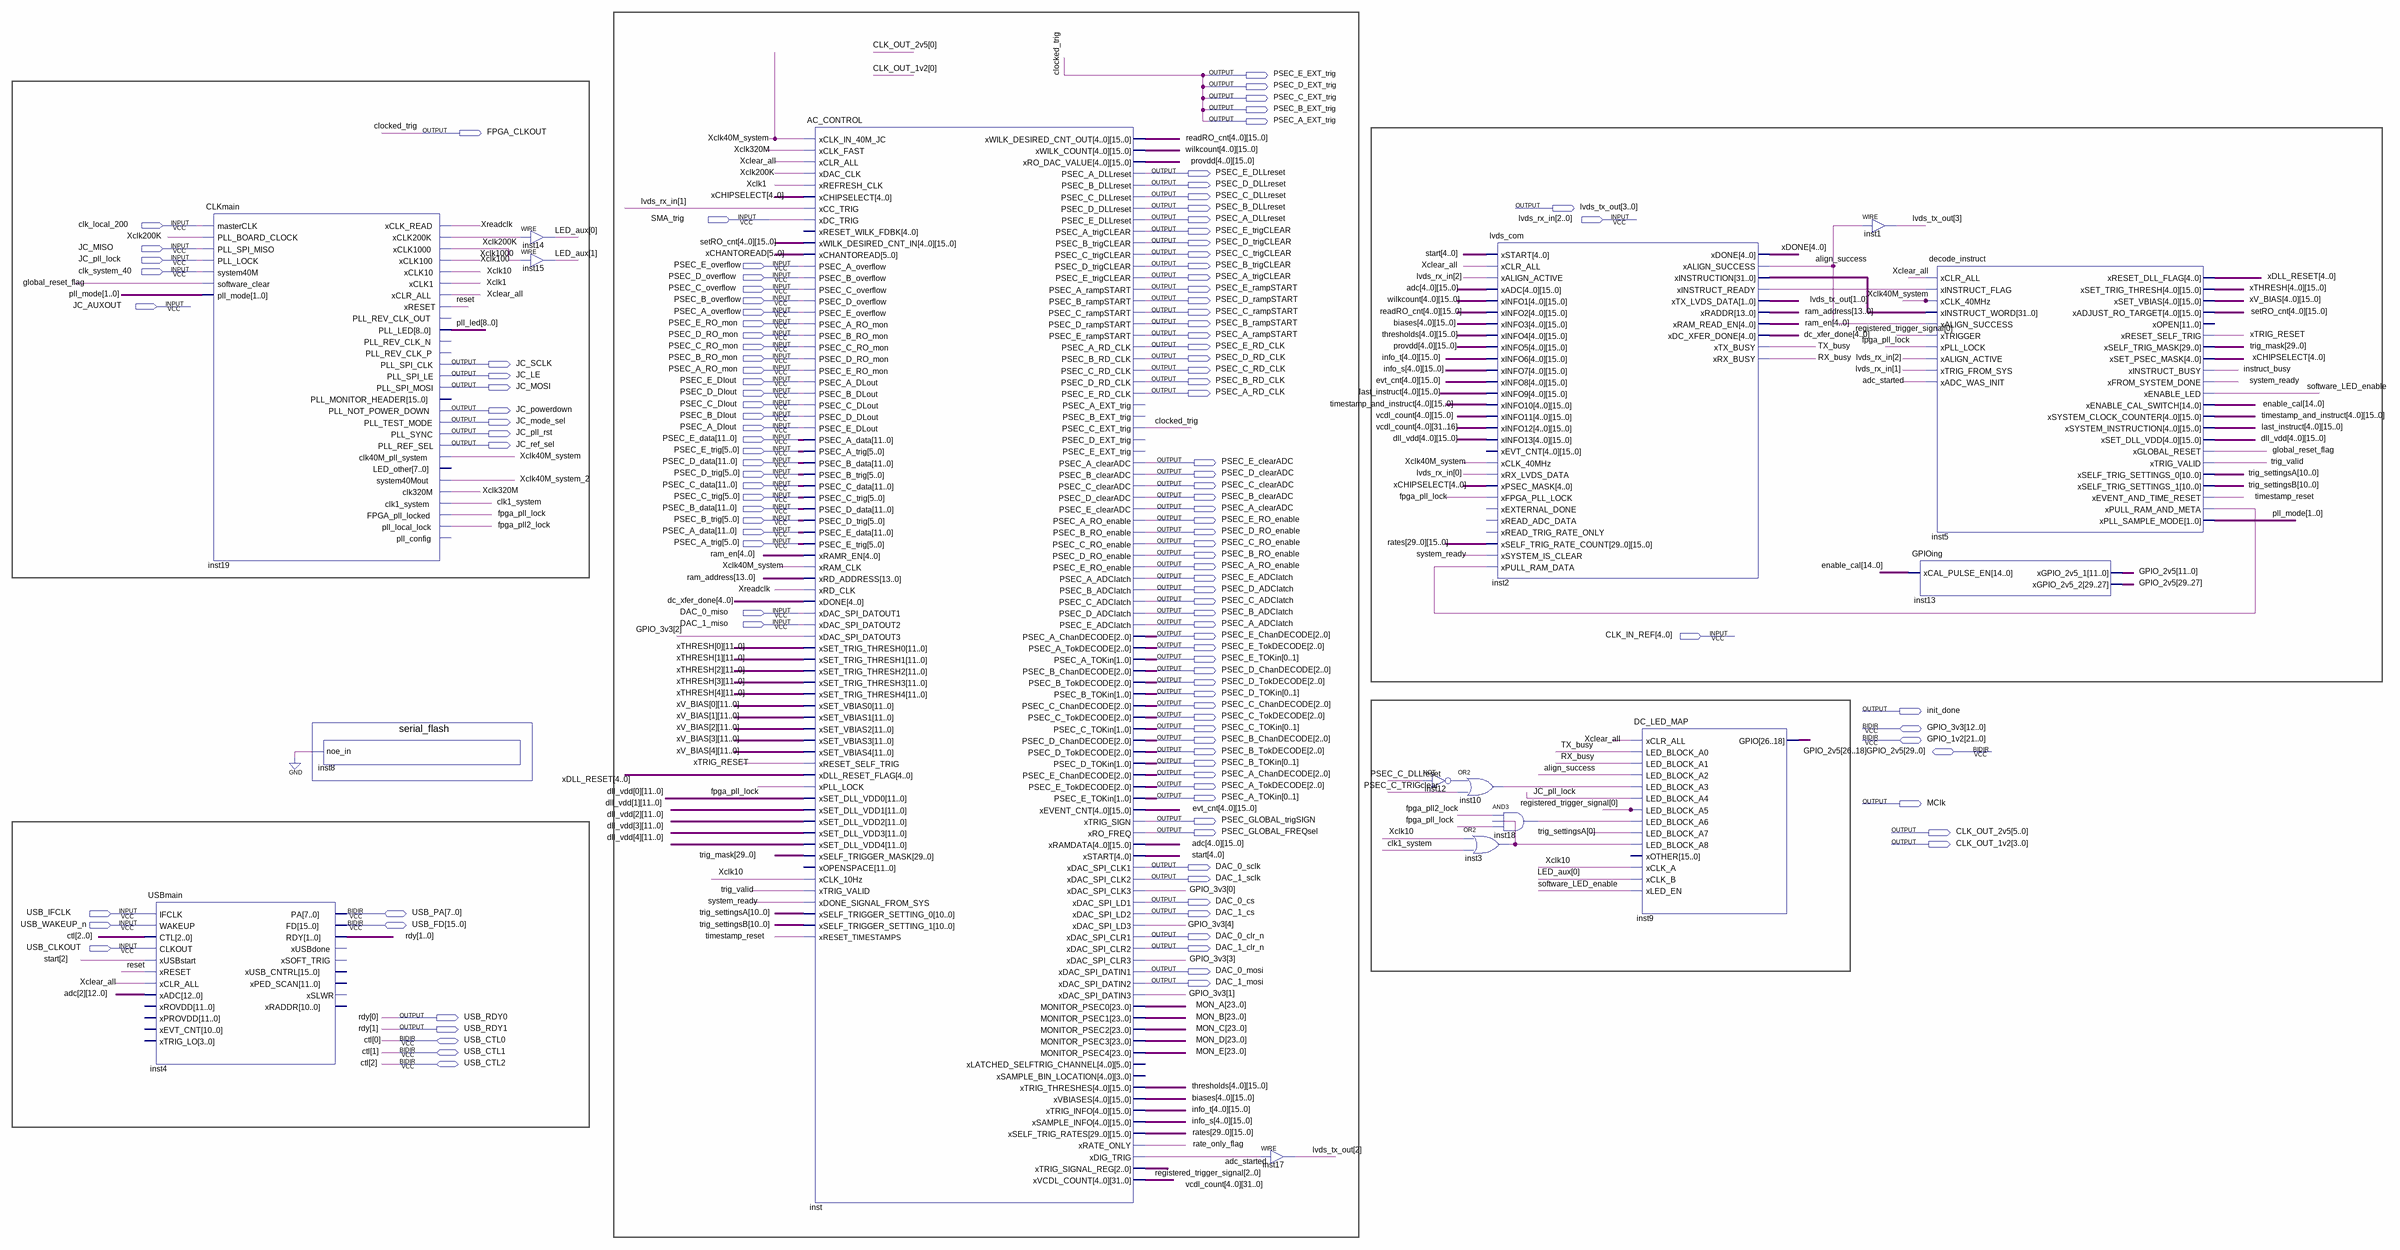
[diagram p0: schematic sheet]
// Quartus schematic ACDC_top_level.bdf as structural Verilog: 16 symbols, 126 pins
module ACDC_top_level (
  input  SMA_trig,
  input  [2:0] lvds_rx_in,
  input  clk_local_200,
  input  JC_MISO,
  input  JC_pll_lock,
  input  PSEC_E_overflow,
  input  clk_system_40,
  input  PSEC_D_overflow,
  input  PSEC_C_overflow,
  input  PSEC_B_overflow,
  input  JC_AUXOUT,
  input  PSEC_A_overflow,
  input  PSEC_E_RO_mon,
  input  PSEC_D_RO_mon,
  input  PSEC_C_RO_mon,
  input  PSEC_B_RO_mon,
  input  PSEC_A_RO_mon,
  input  PSEC_E_DIout,
  input  PSEC_D_DIout,
  input  PSEC_C_DIout,
  input  PSEC_B_DIout,
  input  PSEC_A_DIout,
  input  [11:0] PSEC_E_data,
  input  [5:0] PSEC_E_trig,
  input  [11:0] PSEC_D_data,
  input  [5:0] PSEC_D_trig,
  input  [11:0] PSEC_C_data,
  input  [5:0] PSEC_C_trig,
  input  [11:0] PSEC_B_data,
  input  [5:0] PSEC_B_trig,
  input  [11:0] PSEC_A_data,
  input  [5:0] PSEC_A_trig,
  input  DAC_0_miso,
  input  DAC_1_miso,
  input  [4:0] CLK_IN_REF,
  input  USB_IFCLK,
  input  USB_WAKEUP_n,
  input  USB_CLKOUT,
  inout  [12:0] GPIO_3v3,
  inout  [21:0] GPIO_1v2,
  inout  [29:0] GPIO_2v5,
  inout  [7:0] USB_PA,
  inout  [15:0] USB_FD,
  inout  USB_CTL0,
  inout  USB_CTL1,
  inout  USB_CTL2,
  output PSEC_E_EXT_trig,
  output PSEC_D_EXT_trig,
  output PSEC_C_EXT_trig,
  output PSEC_B_EXT_trig,
  output PSEC_A_EXT_trig,
  output FPGA_CLKOUT,
  output PSEC_E_DLLreset,
  output PSEC_D_DLLreset,
  output PSEC_C_DLLreset,
  output PSEC_B_DLLreset,
  output [3:0] lvds_tx_out,
  output PSEC_A_DLLreset,
  output PSEC_E_trigCLEAR,
  output PSEC_D_trigCLEAR,
  output PSEC_C_trigCLEAR,
  output PSEC_B_trigCLEAR,
  output PSEC_A_trigCLEAR,
  output PSEC_E_rampSTART,
  output PSEC_D_rampSTART,
  output PSEC_C_rampSTART,
  output PSEC_B_rampSTART,
  output PSEC_A_rampSTART,
  output PSEC_E_RD_CLK,
  output PSEC_D_RD_CLK,
  output JC_SCLK,
  output PSEC_C_RD_CLK,
  output JC_LE,
  output PSEC_B_RD_CLK,
  output JC_MOSI,
  output PSEC_A_RD_CLK,
  output JC_powerdown,
  output JC_mode_sel,
  output JC_pll_rst,
  output JC_ref_sel,
  output PSEC_E_clearADC,
  output PSEC_D_clearADC,
  output PSEC_C_clearADC,
  output PSEC_B_clearADC,
  output PSEC_A_clearADC,
  output PSEC_E_RO_enable,
  output PSEC_D_RO_enable,
  output PSEC_C_RO_enable,
  output PSEC_B_RO_enable,
  output PSEC_A_RO_enable,
  output PSEC_E_ADClatch,
  output PSEC_D_ADClatch,
  output PSEC_C_ADClatch,
  output PSEC_B_ADClatch,
  output PSEC_A_ADClatch,
  output [2:0] PSEC_E_ChanDECODE,
  output [2:0] PSEC_E_TokDECODE,
  output [0:1] PSEC_E_TOKin,
  output [2:0] PSEC_D_ChanDECODE,
  output [2:0] PSEC_D_TokDECODE,
  output [0:1] PSEC_D_TOKin,
  output [2:0] PSEC_C_ChanDECODE,
  output init_done,
  output [2:0] PSEC_C_TokDECODE,
  output [0:1] PSEC_C_TOKin,
  output [2:0] PSEC_B_ChanDECODE,
  output [2:0] PSEC_B_TokDECODE,
  output [0:1] PSEC_B_TOKin,
  output [2:0] PSEC_A_ChanDECODE,
  output [2:0] PSEC_A_TokDECODE,
  output [0:1] PSEC_A_TOKin,
  output MClk,
  output PSEC_GLOBAL_trigSIGN,
  output PSEC_GLOBAL_FREQsel,
  output [5:0] CLK_OUT_2v5,
  output [3:0] CLK_OUT_1v2,
  output DAC_0_sclk,
  output DAC_1_sclk,
  output DAC_0_cs,
  output DAC_1_cs,
  output DAC_0_clr_n,
  output DAC_1_clr_n,
  output DAC_0_mosi,
  output DAC_1_mosi,
  output USB_RDY0,
  output USB_RDY1
);

  wire adc_started, align_success, clk1_system, fpga_pll2_lock, fpga_pll_lock, global_reset_flag,
       inst2_xinstruct_ready, inst3_out, inst5_xpull_ram_and_meta, inst10_out, inst12_out, inst18_out,
       instruct_busy, rate_only_flag, reset, RX_busy, software_LED_enable, system_ready, timestamp_reset,
       trig_valid, TX_busy, Xclear_all, Xclk1, Xclk10, Xclk40M_system, Xclk40M_system_2, Xclk100, Xclk200K,
       Xclk320M, Xclk1000, Xreadclk, xTRIG_RESET;
  wire [1:0] LED_aux, pll_mode;
  wire [2:0] registered_trigger_signal;
  wire [4:0] dc_xfer_done, ram_en, start, xCHIPSELECT, xDLL_RESET, xDONE;
  wire [5:0] xCHANTOREAD;
  wire [8:0] pll_led;
  wire [10:0] trig_settingsA, trig_settingsB;
  wire [13:0] ram_address;
  wire [14:0] enable_cal;
  wire [15:0] adc_0, adc_1, adc_2, adc_3, adc_4, biases_0, biases_1, biases_2, biases_3, biases_4, dll_vdd_0,
       dll_vdd_1, dll_vdd_2, dll_vdd_3, dll_vdd_4, evt_cnt_0, evt_cnt_1, evt_cnt_2, evt_cnt_3, evt_cnt_4,
       info_s_0, info_s_1, info_s_2, info_s_3, info_s_4, info_t_0, info_t_1, info_t_2, info_t_3, info_t_4,
       last_instruct_0, last_instruct_1, last_instruct_2, last_instruct_3, last_instruct_4, provdd_0,
       provdd_1, provdd_2, provdd_3, provdd_4, rates_0, rates_1, rates_2, rates_3, rates_4, rates_5, rates_6,
       rates_7, rates_8, rates_9, rates_10, rates_11, rates_12, rates_13, rates_14, rates_15, rates_16,
       rates_17, rates_18, rates_19, rates_20, rates_21, rates_22, rates_23, rates_24, rates_25, rates_26,
       rates_27, rates_28, rates_29, readRO_cnt_0, readRO_cnt_1, readRO_cnt_2, readRO_cnt_3, readRO_cnt_4,
       setRO_cnt_0, setRO_cnt_1, setRO_cnt_2, setRO_cnt_3, setRO_cnt_4, thresholds_0, thresholds_1,
       thresholds_2, thresholds_3, thresholds_4, timestamp_and_instruct_0, timestamp_and_instruct_1,
       timestamp_and_instruct_2, timestamp_and_instruct_3, timestamp_and_instruct_4, wilkcount_0,
       wilkcount_1, wilkcount_2, wilkcount_3, wilkcount_4, xTHRESH_0, xTHRESH_1, xTHRESH_2, xTHRESH_3,
       xTHRESH_4, xV_BIAS_0, xV_BIAS_1, xV_BIAS_2, xV_BIAS_3, xV_BIAS_4;
  wire [23:0] MON_A, MON_B, MON_C, MON_D, MON_E;
  wire [29:0] trig_mask;
  wire [31:0] inst2_xinstruction, vcdl_count_0, vcdl_count_1, vcdl_count_2, vcdl_count_3, vcdl_count_4;

  USBmain inst4 (
    .IFCLK(USB_IFCLK), .WAKEUP(USB_WAKEUP_n), .CTL({USB_CTL2, USB_CTL1, USB_CTL0}), .CLKOUT(USB_CLKOUT),
    .xUSBstart(start[2]), .xRESET(reset), .xCLR_ALL(Xclear_all), .xADC(adc_2[12:0]),
    .RDY({USB_RDY1, USB_RDY0}), .PA(USB_PA), .FD(USB_FD));  // open: xROVDD, xPROVDD, xEVT_CNT, xTRIG_LO, xUSBdone, xSOFT_TRIG, xUSB_CNTRL, xPED_SCAN, xSLWR, xRADDR
  CLKmain inst19 (
    .masterCLK(clk_local_200), .PLL_BOARD_CLOCK(Xclk200K), .PLL_SPI_MISO(JC_MISO), .PLL_LOCK(JC_pll_lock),
    .system40M(clk_system_40), .software_clear(global_reset_flag), .pll_mode(pll_mode), .xCLK_READ(Xreadclk),
    .xCLK200K(Xclk200K), .xCLK1000(Xclk1000), .xCLK100(Xclk100), .xCLK10(Xclk10), .xCLK1(Xclk1),
    .xCLR_ALL(Xclear_all), .xRESET(reset), .PLL_LED(pll_led), .PLL_SPI_CLK(JC_SCLK), .PLL_SPI_LE(JC_LE),
    .PLL_SPI_MOSI(JC_MOSI), .PLL_NOT_POWER_DOWN(JC_powerdown), .PLL_TEST_MODE(JC_mode_sel),
    .PLL_SYNC(JC_pll_rst), .PLL_REF_SEL(JC_ref_sel), .clk40M_pll_system(Xclk40M_system),
    .system40Mout(Xclk40M_system_2), .clk320M(Xclk320M), .clk1_system(clk1_system),
    .FPGA_pll_locked(fpga_pll_lock), .pll_local_lock(fpga_pll2_lock));  // open: PLL_REV_CLK_OUT, PLL_REV_CLK_N, PLL_REV_CLK_P, PLL_MONITOR_HEADER, LED_other, pll_config
  serial_flash inst8 (.noe_in(1'b0));
  assign LED_aux[0] = Xclk200K;  // WIRE inst14
  assign LED_aux[1] = Xclk1000;  // WIRE inst15
  AC_CONTROL inst (
    .xCLK_IN_40M_JC(Xclk40M_system), .xCLK_FAST(Xclk320M), .xCLR_ALL(Xclear_all), .xDAC_CLK(Xclk200K),
    .xREFRESH_CLK(Xclk1), .xCHIPSELECT(xCHIPSELECT), .xCC_TRIG(lvds_rx_in[1]), .xDC_TRIG(SMA_trig),
    .xWILK_DESIRED_CNT_IN({setRO_cnt_4, setRO_cnt_3, setRO_cnt_2, setRO_cnt_1, setRO_cnt_0}),
    .xCHANTOREAD(xCHANTOREAD), .PSEC_A_overflow(PSEC_E_overflow), .PSEC_B_overflow(PSEC_D_overflow),
    .PSEC_C_overflow(PSEC_C_overflow), .PSEC_D_overflow(PSEC_B_overflow), .PSEC_E_overflow(PSEC_A_overflow),
    .PSEC_A_RO_mon(PSEC_E_RO_mon), .PSEC_B_RO_mon(PSEC_D_RO_mon), .PSEC_C_RO_mon(PSEC_C_RO_mon),
    .PSEC_D_RO_mon(PSEC_B_RO_mon), .PSEC_E_RO_mon(PSEC_A_RO_mon), .PSEC_A_DLout(PSEC_E_DIout),
    .PSEC_B_DLout(PSEC_D_DIout), .PSEC_C_DLout(PSEC_C_DIout), .PSEC_D_DLout(PSEC_B_DIout),
    .PSEC_E_DLout(PSEC_A_DIout), .PSEC_A_data(PSEC_E_data), .PSEC_A_trig(PSEC_E_trig),
    .PSEC_B_data(PSEC_D_data), .PSEC_B_trig(PSEC_D_trig), .PSEC_C_data(PSEC_C_data),
    .PSEC_C_trig(PSEC_C_trig), .PSEC_D_data(PSEC_B_data), .PSEC_D_trig(PSEC_B_trig),
    .PSEC_E_data(PSEC_A_data), .PSEC_E_trig(PSEC_A_trig), .xRAMR_EN(ram_en), .xRAM_CLK(Xclk40M_system),
    .xRD_ADDRESS(ram_address), .xRD_CLK(Xreadclk), .xDONE(dc_xfer_done), .xDAC_SPI_DATOUT1(DAC_0_miso),
    .xDAC_SPI_DATOUT2(DAC_1_miso), .xDAC_SPI_DATOUT3(GPIO_3v3[2]), .xSET_TRIG_THRESH0(xTHRESH_0[11:0]),
    .xSET_TRIG_THRESH1(xTHRESH_1[11:0]), .xSET_TRIG_THRESH2(xTHRESH_2[11:0]),
    .xSET_TRIG_THRESH3(xTHRESH_3[11:0]), .xSET_TRIG_THRESH4(xTHRESH_4[11:0]), .xSET_VBIAS0(xV_BIAS_0[11:0]),
    .xSET_VBIAS1(xV_BIAS_1[11:0]), .xSET_VBIAS2(xV_BIAS_2[11:0]), .xSET_VBIAS3(xV_BIAS_3[11:0]),
    .xSET_VBIAS4(xV_BIAS_4[11:0]), .xRESET_SELF_TRIG(xTRIG_RESET), .xDLL_RESET_FLAG(xDLL_RESET),
    .xPLL_LOCK(fpga_pll_lock), .xSET_DLL_VDD0(dll_vdd_0[11:0]), .xSET_DLL_VDD1(dll_vdd_1[11:0]),
    .xSET_DLL_VDD2(dll_vdd_2[11:0]), .xSET_DLL_VDD3(dll_vdd_3[11:0]), .xSET_DLL_VDD4(dll_vdd_4[11:0]),
    .xSELF_TRIGGER_MASK(trig_mask), .xCLK_10Hz(Xclk10), .xTRIG_VALID(trig_valid),
    .xDONE_SIGNAL_FROM_SYS(system_ready), .xSELF_TRIGGER_SETTING_0(trig_settingsA),
    .xSELF_TRIGGER_SETTING_1(trig_settingsB), .xRESET_TIMESTAMPS(timestamp_reset),
    .xWILK_DESIRED_CNT_OUT({readRO_cnt_4, readRO_cnt_3, readRO_cnt_2, readRO_cnt_1, readRO_cnt_0}),
    .xWILK_COUNT({wilkcount_4, wilkcount_3, wilkcount_2, wilkcount_1, wilkcount_0}),
    .xRO_DAC_VALUE({provdd_4, provdd_3, provdd_2, provdd_1, provdd_0}), .PSEC_A_DLLreset(PSEC_E_DLLreset),
    .PSEC_B_DLLreset(PSEC_D_DLLreset), .PSEC_C_DLLreset(PSEC_C_DLLreset), .PSEC_D_DLLreset(PSEC_B_DLLreset),
    .PSEC_E_DLLreset(PSEC_A_DLLreset), .PSEC_A_trigCLEAR(PSEC_E_trigCLEAR),
    .PSEC_B_trigCLEAR(PSEC_D_trigCLEAR), .PSEC_C_trigCLEAR(PSEC_C_trigCLEAR),
    .PSEC_D_trigCLEAR(PSEC_B_trigCLEAR), .PSEC_E_trigCLEAR(PSEC_A_trigCLEAR),
    .PSEC_A_rampSTART(PSEC_E_rampSTART), .PSEC_B_rampSTART(PSEC_D_rampSTART),
    .PSEC_C_rampSTART(PSEC_C_rampSTART), .PSEC_D_rampSTART(PSEC_B_rampSTART),
    .PSEC_E_rampSTART(PSEC_A_rampSTART), .PSEC_A_RD_CLK(PSEC_E_RD_CLK), .PSEC_B_RD_CLK(PSEC_D_RD_CLK),
    .PSEC_C_RD_CLK(PSEC_C_RD_CLK), .PSEC_D_RD_CLK(PSEC_B_RD_CLK), .PSEC_E_RD_CLK(PSEC_A_RD_CLK),
    .PSEC_C_EXT_trig(FPGA_CLKOUT), .PSEC_A_clearADC(PSEC_E_clearADC), .PSEC_B_clearADC(PSEC_D_clearADC),
    .PSEC_C_clearADC(PSEC_C_clearADC), .PSEC_D_clearADC(PSEC_B_clearADC), .PSEC_E_clearADC(PSEC_A_clearADC),
    .PSEC_A_RO_enable(PSEC_E_RO_enable), .PSEC_B_RO_enable(PSEC_D_RO_enable),
    .PSEC_C_RO_enable(PSEC_C_RO_enable), .PSEC_D_RO_enable(PSEC_B_RO_enable),
    .PSEC_E_RO_enable(PSEC_A_RO_enable), .PSEC_A_ADClatch(PSEC_E_ADClatch),
    .PSEC_B_ADClatch(PSEC_D_ADClatch), .PSEC_C_ADClatch(PSEC_C_ADClatch), .PSEC_D_ADClatch(PSEC_B_ADClatch),
    .PSEC_E_ADClatch(PSEC_A_ADClatch), .PSEC_A_ChanDECODE(PSEC_E_ChanDECODE),
    .PSEC_A_TokDECODE(PSEC_E_TokDECODE), .PSEC_A_TOKin(PSEC_E_TOKin), .PSEC_B_ChanDECODE(PSEC_D_ChanDECODE),
    .PSEC_B_TokDECODE(PSEC_D_TokDECODE), .PSEC_B_TOKin(PSEC_D_TOKin), .PSEC_C_ChanDECODE(PSEC_C_ChanDECODE),
    .PSEC_C_TokDECODE(PSEC_C_TokDECODE), .PSEC_C_TOKin(PSEC_C_TOKin), .PSEC_D_ChanDECODE(PSEC_B_ChanDECODE),
    .PSEC_D_TokDECODE(PSEC_B_TokDECODE), .PSEC_D_TOKin(PSEC_B_TOKin), .PSEC_E_ChanDECODE(PSEC_A_ChanDECODE),
    .PSEC_E_TokDECODE(PSEC_A_TokDECODE), .PSEC_E_TOKin(PSEC_A_TOKin),
    .xEVENT_CNT({evt_cnt_4, evt_cnt_3, evt_cnt_2, evt_cnt_1, evt_cnt_0}), .xTRIG_SIGN(PSEC_GLOBAL_trigSIGN),
    .xRO_FREQ(PSEC_GLOBAL_FREQsel), .xRAMDATA({adc_4, adc_3, adc_2, adc_1, adc_0}), .xSTART(start),
    .xDAC_SPI_CLK1(DAC_0_sclk), .xDAC_SPI_CLK2(DAC_1_sclk), .xDAC_SPI_CLK3(GPIO_3v3[0]),
    .xDAC_SPI_LD1(DAC_0_cs), .xDAC_SPI_LD2(DAC_1_cs), .xDAC_SPI_LD3(GPIO_3v3[4]),
    .xDAC_SPI_CLR1(DAC_0_clr_n), .xDAC_SPI_CLR2(DAC_1_clr_n), .xDAC_SPI_CLR3(GPIO_3v3[3]),
    .xDAC_SPI_DATIN1(DAC_0_mosi), .xDAC_SPI_DATIN2(DAC_1_mosi), .xDAC_SPI_DATIN3(GPIO_3v3[1]),
    .MONITOR_PSEC0(MON_A), .MONITOR_PSEC1(MON_B), .MONITOR_PSEC2(MON_C), .MONITOR_PSEC3(MON_D),
    .MONITOR_PSEC4(MON_E),
    .xTRIG_THRESHES({thresholds_4, thresholds_3, thresholds_2, thresholds_1, thresholds_0}),
    .xVBIASES({biases_4, biases_3, biases_2, biases_1, biases_0}),
    .xTRIG_INFO({info_t_4, info_t_3, info_t_2, info_t_1, info_t_0}),
    .xSAMPLE_INFO({info_s_4, info_s_3, info_s_2, info_s_1, info_s_0}),
    .xSELF_TRIG_RATES({rates_29, rates_28, rates_27, rates_26, rates_25, rates_24, rates_23, rates_22, rates_21, rates_20, rates_19, rates_18, rates_17, rates_16, rates_15, rates_14, rates_13, rates_12, rates_11, rates_10, rates_9, rates_8, rates_7, rates_6, rates_5, rates_4, rates_3, rates_2, rates_1, rates_0}),
    .xRATE_ONLY(rate_only_flag), .xDIG_TRIG(adc_started), .xTRIG_SIGNAL_REG(registered_trigger_signal),
    .xVCDL_COUNT({vcdl_count_4, vcdl_count_3, vcdl_count_2, vcdl_count_1, vcdl_count_0}));  // open: xRESET_WILK_FDBK, xOPENSPACE, PSEC_A_EXT_trig, PSEC_B_EXT_trig, PSEC_D_EXT_trig, PSEC_E_EXT_trig, xLATCHED_SELFTRIG_CHANNEL, xSAMPLE_BIN_LOCATION
  assign lvds_tx_out[2] = adc_started;  // WIRE inst17
  or inst10 (inst10_out, inst12_out, PSEC_C_trigCLEAR);
  not inst12 (inst12_out, PSEC_C_DLLreset);
  or inst3 (inst3_out, Xclk10, clk1_system);
  lvds_com inst2 (
    .xSTART(start), .xCLR_ALL(Xclear_all), .xALIGN_ACTIVE(lvds_rx_in[2]),
    .xADC({adc_4, adc_3, adc_2, adc_1, adc_0}),
    .xINFO1({wilkcount_4, wilkcount_3, wilkcount_2, wilkcount_1, wilkcount_0}),
    .xINFO2({readRO_cnt_4, readRO_cnt_3, readRO_cnt_2, readRO_cnt_1, readRO_cnt_0}),
    .xINFO3({biases_4, biases_3, biases_2, biases_1, biases_0}),
    .xINFO4({thresholds_4, thresholds_3, thresholds_2, thresholds_1, thresholds_0}),
    .xINFO5({provdd_4, provdd_3, provdd_2, provdd_1, provdd_0}),
    .xINFO6({info_t_4, info_t_3, info_t_2, info_t_1, info_t_0}),
    .xINFO7({info_s_4, info_s_3, info_s_2, info_s_1, info_s_0}),
    .xINFO8({evt_cnt_4, evt_cnt_3, evt_cnt_2, evt_cnt_1, evt_cnt_0}),
    .xINFO9({last_instruct_4, last_instruct_3, last_instruct_2, last_instruct_1, last_instruct_0}),
    .xINFO10({timestamp_and_instruct_4, timestamp_and_instruct_3, timestamp_and_instruct_2, timestamp_and_instruct_1, timestamp_and_instruct_0}),
    .xINFO11({vcdl_count_4[15:0], vcdl_count_3[15:0], vcdl_count_2[15:0], vcdl_count_1[15:0], vcdl_count_0[15:0]}),
    .xINFO12({vcdl_count_4[31:16], vcdl_count_3[31:16], vcdl_count_2[31:16], vcdl_count_1[31:16], vcdl_count_0[31:16]}),
    .xINFO13({dll_vdd_4, dll_vdd_3, dll_vdd_2, dll_vdd_1, dll_vdd_0}), .xCLK_40MHz(Xclk40M_system),
    .xRX_LVDS_DATA(lvds_rx_in[0]), .xPSEC_MASK(xCHIPSELECT), .xFPGA_PLL_LOCK(fpga_pll_lock),
    .xSELF_TRIG_RATE_COUNT({rates_29, rates_28, rates_27, rates_26, rates_25, rates_24, rates_23, rates_22, rates_21, rates_20, rates_19, rates_18, rates_17, rates_16, rates_15, rates_14, rates_13, rates_12, rates_11, rates_10, rates_9, rates_8, rates_7, rates_6, rates_5, rates_4, rates_3, rates_2, rates_1, rates_0}),
    .xSYSTEM_IS_CLEAR(system_ready), .xPULL_RAM_DATA(inst5_xpull_ram_and_meta), .xDONE(xDONE),
    .xALIGN_SUCCESS(align_success), .xINSTRUCTION(inst2_xinstruction),
    .xINSTRUCT_READY(inst2_xinstruct_ready), .xTX_LVDS_DATA(lvds_tx_out[1:0]), .xRADDR(ram_address),
    .xRAM_READ_EN(ram_en), .xDC_XFER_DONE(dc_xfer_done), .xTX_BUSY(TX_busy), .xRX_BUSY(RX_busy));  // open: xEVT_CNT, xEXTERNAL_DONE, xREAD_ADC_DATA, xREAD_TRIG_RATE_ONLY
  and inst18 (inst18_out, fpga_pll2_lock, inst3_out, fpga_pll_lock);
  DC_LED_MAP inst9 (
    .xCLR_ALL(Xclear_all), .LED_BLOCK_A0(TX_busy), .LED_BLOCK_A1(RX_busy), .LED_BLOCK_A2(align_success),
    .LED_BLOCK_A3(inst10_out), .LED_BLOCK_A4(JC_pll_lock), .LED_BLOCK_A5(registered_trigger_signal[0]),
    .LED_BLOCK_A6(inst18_out), .LED_BLOCK_A7(trig_settingsA[0]), .LED_BLOCK_A8(inst3_out), .xCLK_A(Xclk10),
    .xCLK_B(LED_aux[0]), .xLED_EN(software_LED_enable), .GPIO(GPIO_2v5[26:18]));  // open: xOTHER
  assign lvds_tx_out[3] = align_success;  // WIRE inst1
  decode_instruct inst5 (
    .xCLR_ALL(Xclear_all), .xINSTRUCT_FLAG(inst2_xinstruct_ready), .xCLK_40MHz(Xclk40M_system),
    .xINSTRUCT_WORD(inst2_xinstruction), .xALIGN_SUCCESS(align_success),
    .xTRIGGER(registered_trigger_signal[0]), .xPLL_LOCK(fpga_pll_lock), .xALIGN_ACTIVE(lvds_rx_in[2]),
    .xTRIG_FROM_SYS(lvds_rx_in[1]), .xADC_WAS_INIT(adc_started), .xRESET_DLL_FLAG(xDLL_RESET),
    .xSET_TRIG_THRESH({xTHRESH_4, xTHRESH_3, xTHRESH_2, xTHRESH_1, xTHRESH_0}),
    .xSET_VBIAS({xV_BIAS_4, xV_BIAS_3, xV_BIAS_2, xV_BIAS_1, xV_BIAS_0}),
    .xADJUST_RO_TARGET({setRO_cnt_4, setRO_cnt_3, setRO_cnt_2, setRO_cnt_1, setRO_cnt_0}),
    .xRESET_SELF_TRIG(xTRIG_RESET), .xSELF_TRIG_MASK(trig_mask), .xSET_PSEC_MASK(xCHIPSELECT),
    .xINSTRUCT_BUSY(instruct_busy), .xFROM_SYSTEM_DONE(system_ready), .xENABLE_LED(software_LED_enable),
    .xENABLE_CAL_SWITCH(enable_cal),
    .xSYSTEM_CLOCK_COUNTER({timestamp_and_instruct_4, timestamp_and_instruct_3, timestamp_and_instruct_2, timestamp_and_instruct_1, timestamp_and_instruct_0}),
    .xSYSTEM_INSTRUCTION({last_instruct_4, last_instruct_3, last_instruct_2, last_instruct_1, last_instruct_0}),
    .xSET_DLL_VDD({dll_vdd_4, dll_vdd_3, dll_vdd_2, dll_vdd_1, dll_vdd_0}),
    .xGLOBAL_RESET(global_reset_flag), .xTRIG_VALID(trig_valid), .xSELF_TRIG_SETTINGS_0(trig_settingsA),
    .xSELF_TRIG_SETTINGS_1(trig_settingsB), .xEVENT_AND_TIME_RESET(timestamp_reset),
    .xPULL_RAM_AND_META(inst5_xpull_ram_and_meta), .xPLL_SAMPLE_MODE(pll_mode));  // open: xOPEN
  GPIOing inst13 (.xCAL_PULSE_EN(enable_cal), .xGPIO_2v5_1(GPIO_2v5[11:0]), .xGPIO_2v5_2(GPIO_2v5[29:27]));

  assign PSEC_A_EXT_trig = FPGA_CLKOUT;
  assign PSEC_B_EXT_trig = FPGA_CLKOUT;
  assign PSEC_C_EXT_trig = FPGA_CLKOUT;
  assign PSEC_D_EXT_trig = FPGA_CLKOUT;
  assign PSEC_E_EXT_trig = FPGA_CLKOUT;

  // Other names for the same wires on the sheet: ctl[2:0] = {USB_CTL2, USB_CTL1, USB_CTL0};
  //   clocked_trig = FPGA_CLKOUT; rdy[1:0] = {USB_RDY1, USB_RDY0}
endmodule
